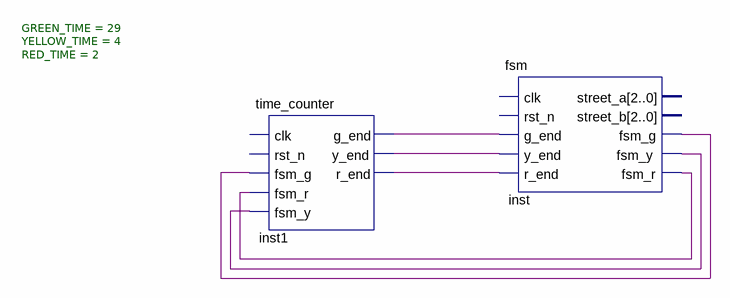
[diagram p0: schematic sheet]
// Quartus schematic Block_connection.bdf as structural Verilog: 2 symbols, 0 pins
module Block_connection (
);

  wire inst1_g_end, inst1_r_end, inst1_y_end, inst_fsm_g, inst_fsm_r, inst_fsm_y;

  time_counter #(.GREEN_TIME(29), .YELLOW_TIME(4), .RED_TIME(2)) inst1 (
    .fsm_g(inst_fsm_g), .fsm_r(inst_fsm_r), .fsm_y(inst_fsm_y), .g_end(inst1_g_end), .y_end(inst1_y_end),
    .r_end(inst1_r_end));  // open: clk, rst_n
  fsm inst (
    .g_end(inst1_g_end), .y_end(inst1_y_end), .r_end(inst1_r_end), .fsm_g(inst_fsm_g), .fsm_y(inst_fsm_y),
    .fsm_r(inst_fsm_r));  // open: clk, rst_n, street_a, street_b
endmodule
